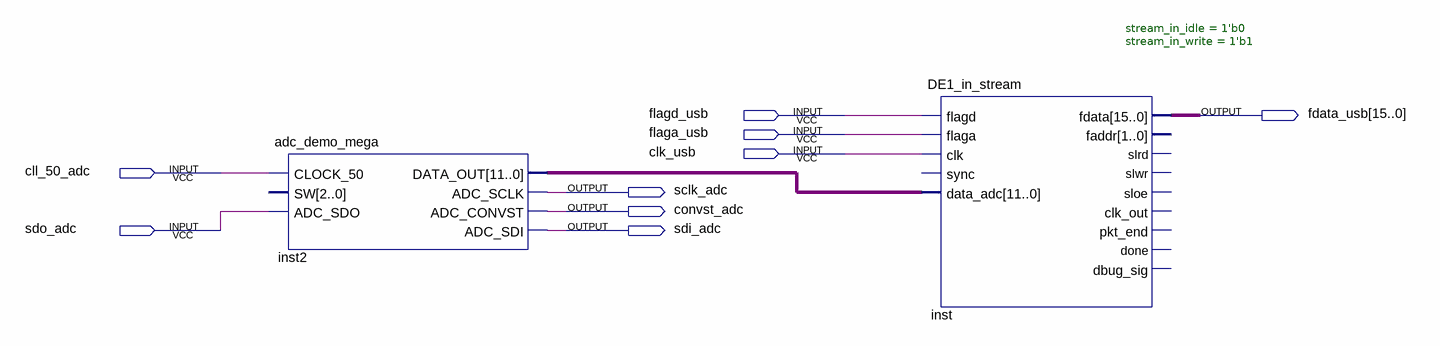
[diagram p0: schematic sheet]
// Quartus schematic blocks.bdf as structural Verilog: 2 symbols, 9 pins
module blocks (
  input  flagd_usb,
  input  flaga_usb,
  input  clk_usb,
  input  cll_50_adc,
  input  sdo_adc,
  output [15:0] fdata_usb,
  output sclk_adc,
  output convst_adc,
  output sdi_adc
);

  wire [11:0] inst2_data_out;

  adc_demo_mega inst2 (
    .CLOCK_50(cll_50_adc), .ADC_SDO(sdo_adc), .DATA_OUT(inst2_data_out), .ADC_SCLK(sclk_adc),
    .ADC_CONVST(convst_adc), .ADC_SDI(sdi_adc));  // open: SW
  DE1_in_stream #(.stream_in_idle(1'b0), .stream_in_write(1'b1)) inst (
    .flagd(flagd_usb), .flaga(flaga_usb), .clk(clk_usb), .data_adc(inst2_data_out), .fdata(fdata_usb));  // open: sync, faddr, slrd, slwr, sloe, clk_out, pkt_end, done, dbug_sig
endmodule
